# EAGLE design ecg_prototype_2 (EAGLE 9.6.1)
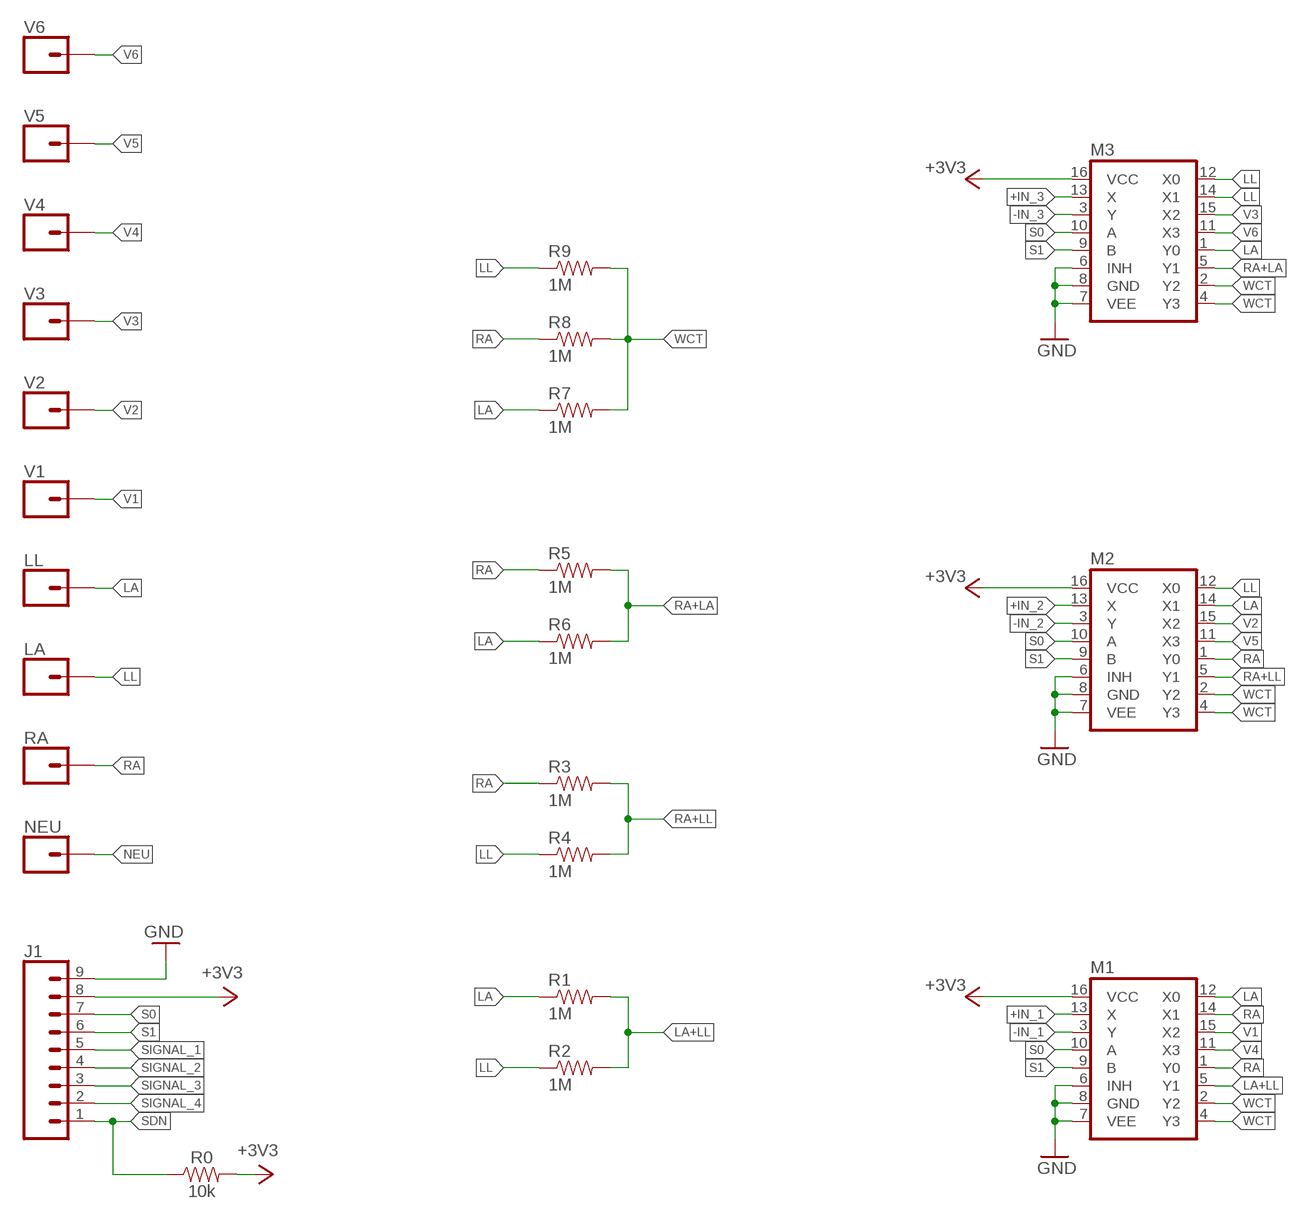
[diagram p0: schematic, sheet 1, part 1 of 2]
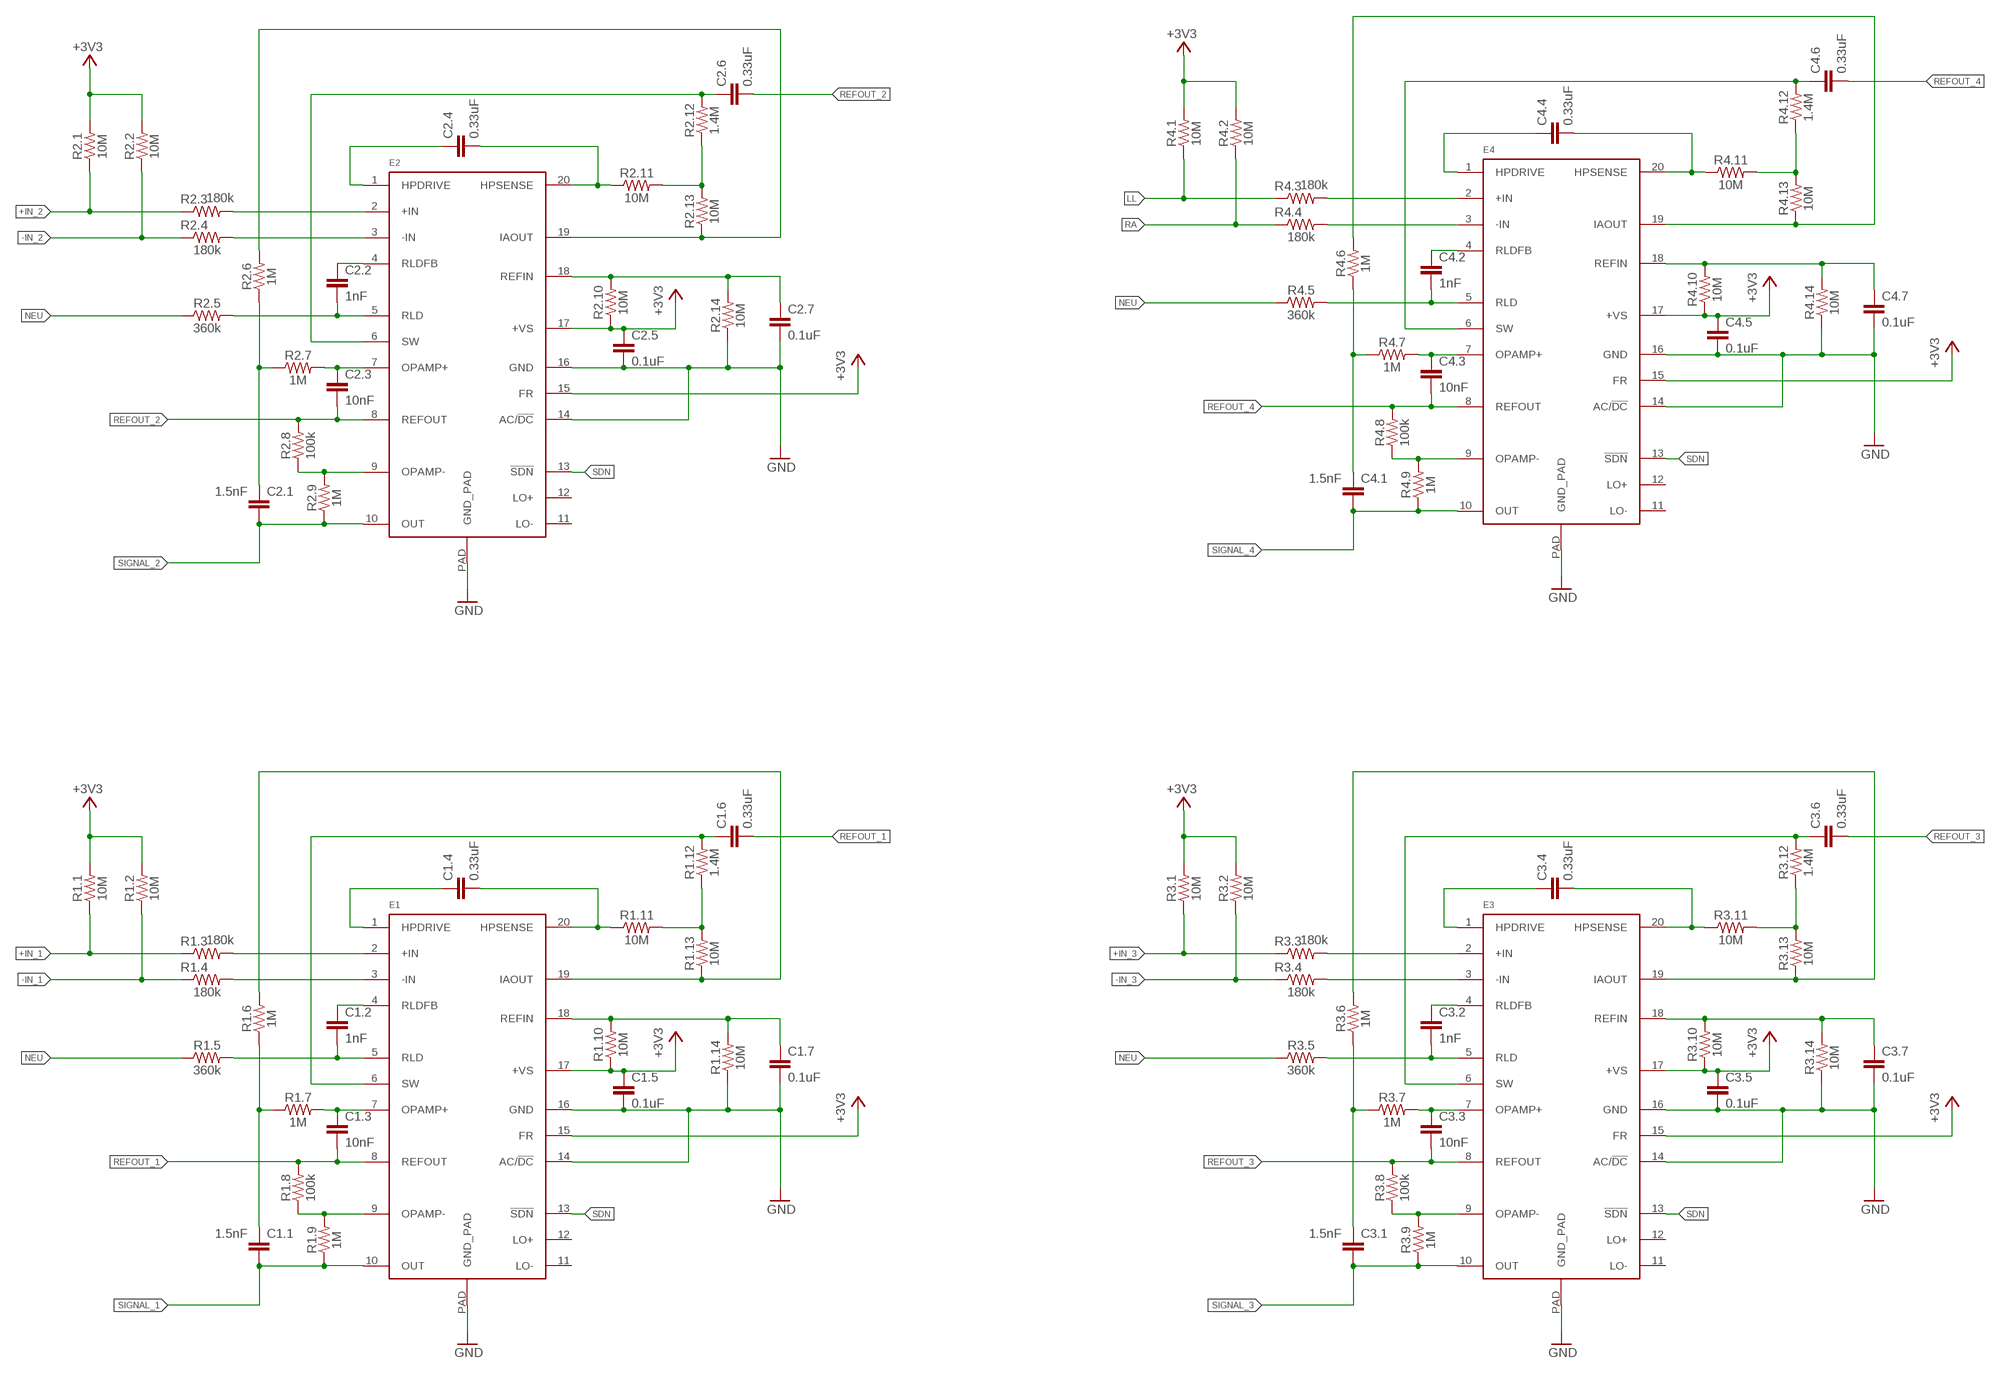
[diagram p1: schematic, sheet 1, part 2 of 2]

## Parts
C1.1  1.5nF  CAP0603-CAP  [0603-CAP]
C1.2  1nF  CAP0603-CAP  [0603-CAP]
C1.3  10nF  CAP0603-CAP  [0603-CAP]
C1.4  0.33uF  CAP0805  [0805]
C1.5  0.1uF  CAP0603-CAP  [0603-CAP]
C1.6  0.33uF  CAP0805  [0805]
C1.7  0.1uF  CAP0603-CAP  [0603-CAP]
C2.1  1.5nF  CAP0603-CAP  [0603-CAP]
C2.2  1nF  CAP0603-CAP  [0603-CAP]
C2.3  10nF  CAP0603-CAP  [0603-CAP]
C2.4  0.33uF  CAP0805  [0805]
C2.5  0.1uF  CAP0603-CAP  [0603-CAP]
C2.6  0.33uF  CAP0805  [0805]
C2.7  0.1uF  CAP0603-CAP  [0603-CAP]
C3.1  1.5nF  CAP0603-CAP  [0603-CAP]
C3.2  1nF  CAP0603-CAP  [0603-CAP]
C3.3  10nF  CAP0603-CAP  [0603-CAP]
C3.4  0.33uF  CAP0805  [0805]
C3.5  0.1uF  CAP0603-CAP  [0603-CAP]
C3.6  0.33uF  CAP0805  [0805]
C3.7  0.1uF  CAP0603-CAP  [0603-CAP]
C4.1  1.5nF  CAP0603-CAP  [0603-CAP]
C4.2  1nF  CAP0603-CAP  [0603-CAP]
C4.3  10nF  CAP0603-CAP  [0603-CAP]
C4.4  0.33uF  CAP0805  [0805]
C4.5  0.1uF  CAP0603-CAP  [0603-CAP]
C4.6  0.33uF  CAP0805  [0805]
C4.7  0.1uF  CAP0603-CAP  [0603-CAP]
E1  AD8232ACPZ-R7  AD8232  [LFCSP_20]
E2  AD8232ACPZ-R7  AD8232  [LFCSP_20]
E3  AD8232ACPZ-R7  AD8232  [LFCSP_20]
E4  AD8232ACPZ-R7  AD8232  [LFCSP_20]
J1  CONN_09  [1X09]
LA  CONN_01  [1X01]
LL  CONN_01  [1X01]
M1  74HC4052D  [SO16]
M2  74HC4052D  [SO16]
M3  74HC4052D  [SO16]
NEU  CONN_01  [1X01]
R0  10k  10KOHM-0603-1/10W-1%  [0603]
R1  1M  RESISTOR0402-RES  [0402-RES]
R1.1  10M  RESISTOR0603  [0603]
R1.2  10M  RESISTOR0603  [0603]
R1.3  180k  RESISTOR0603  [0603]
R1.4  180k  RESISTOR0603  [0603]
R1.5  360k  RESISTOR0603  [0603]
R1.6  1M  RESISTOR0603  [0603]
R1.7  1M  RESISTOR0603  [0603]
R1.8  100k  RESISTOR0603  [0603]
R1.9  1M  RESISTOR0603  [0603]
R1.10  10M  RESISTOR0603  [0603]
R1.11  10M  RESISTOR0603  [0603]
R1.12  1.4M  RESISTOR0603  [0603]
R1.13  10M  RESISTOR0603  [0603]
R1.14  10M  RESISTOR0603  [0603]
R2  1M  RESISTOR0402-RES  [0402-RES]
R2.1  10M  RESISTOR0603  [0603]
R2.2  10M  RESISTOR0603  [0603]
R2.3  180k  RESISTOR0603  [0603]
R2.4  180k  RESISTOR0603  [0603]
R2.5  360k  RESISTOR0603  [0603]
R2.6  1M  RESISTOR0603  [0603]
R2.7  1M  RESISTOR0603  [0603]
R2.8  100k  RESISTOR0603  [0603]
R2.9  1M  RESISTOR0603  [0603]
R2.10  10M  RESISTOR0603  [0603]
R2.11  10M  RESISTOR0603  [0603]
R2.12  1.4M  RESISTOR0603  [0603]
R2.13  10M  RESISTOR0603  [0603]
R2.14  10M  RESISTOR0603  [0603]
R3  1M  RESISTOR0402-RES  [0402-RES]
R3.1  10M  RESISTOR0603  [0603]
R3.2  10M  RESISTOR0603  [0603]
R3.3  180k  RESISTOR0603  [0603]
R3.4  180k  RESISTOR0603  [0603]
R3.5  360k  RESISTOR0603  [0603]
R3.6  1M  RESISTOR0603  [0603]
R3.7  1M  RESISTOR0603  [0603]
R3.8  100k  RESISTOR0603  [0603]
R3.9  1M  RESISTOR0603  [0603]
R3.10  10M  RESISTOR0603  [0603]
R3.11  10M  RESISTOR0603  [0603]
R3.12  1.4M  RESISTOR0603  [0603]
R3.13  10M  RESISTOR0603  [0603]
R3.14  10M  RESISTOR0603  [0603]
R4  1M  RESISTOR0402-RES  [0402-RES]
R4.1  10M  RESISTOR0603  [0603]
R4.2  10M  RESISTOR0603  [0603]
R4.3  180k  RESISTOR0603  [0603]
R4.4  180k  RESISTOR0603  [0603]
R4.5  360k  RESISTOR0603  [0603]
R4.6  1M  RESISTOR0603  [0603]
R4.7  1M  RESISTOR0603  [0603]
R4.8  100k  RESISTOR0603  [0603]
R4.9  1M  RESISTOR0603  [0603]
R4.10  10M  RESISTOR0603  [0603]
R4.11  10M  RESISTOR0603  [0603]
R4.12  1.4M  RESISTOR0603  [0603]
R4.13  10M  RESISTOR0603  [0603]
R4.14  10M  RESISTOR0603  [0603]
R5  1M  RESISTOR0402-RES  [0402-RES]
R6  1M  RESISTOR0402-RES  [0402-RES]
R7  1M  RESISTOR0402-RES  [0402-RES]
R8  1M  RESISTOR0402-RES  [0402-RES]
R9  1M  RESISTOR0402-RES  [0402-RES]
RA  CONN_01  [1X01]
V1  CONN_01  [1X01]
V2  CONN_01  [1X01]
V3  CONN_01  [1X01]
V4  CONN_01  [1X01]
V5  CONN_01  [1X01]
V6  CONN_01  [1X01]

## Nets
+3V3: C1.5.1 C2.5.1 C3.5.1 C4.5.1 E1.15(FR) E1.17(+VS) E2.15(FR) E2.17(+VS) E3.15(FR) E3.17(+VS) E4.15(FR) E4.17(+VS) J1.8 M1.16(VCC) M2.16(VCC) M3.16(VCC) R0.2 R1.1.2 R1.2.2 R1.10.1 R2.1.2 R2.2.2 R2.10.1 R3.1.2 R3.2.2 R3.10.1 R4.1.2 R4.2.2 R4.10.1
+IN_1: M1.13(X) R1.1.1 R1.3.1
+IN_2: M2.13(X) R2.1.1 R2.3.1
+IN_3: M3.13(X) R3.1.1 R3.3.1
-IN_1: M1.3(Y) R1.2.1 R1.4.1
-IN_2: M2.3(Y) R2.2.1 R2.4.1
-IN_3: M3.3(Y) R3.2.1 R3.4.1
GND: C1.5.2 C1.7.2 C2.5.2 C2.7.2 C3.5.2 C3.7.2 C4.5.2 C4.7.2 E1.14(AC/!DC) E1.16(GND) E1.PAD(GND_PAD) E2.14(AC/!DC) E2.16(GND) E2.PAD(GND_PAD) E3.14(AC/!DC) E3.16(GND) E3.PAD(GND_PAD) E4.14(AC/!DC) E4.16(GND) E4.PAD(GND_PAD) J1.9 M1.6(INH) M1.7(VEE) M1.8(GND) M2.6(INH) M2.7(VEE) M2.8(GND) M3.6(INH) M3.7(VEE) M3.8(GND) R1.14.1 R2.14.1 R3.14.1 R4.14.1
LA: LL.1 M1.12(X0) M2.14(X1) M3.1(Y0) R1.1 R6.1 R7.1
LA+LL: M1.5(Y1) R1.2 R2.2
LL: LA.1 M2.12(X0) M3.12(X0) M3.14(X1) R2.1 R4.1 R4.1.1 R4.3.1 R9.1
N$1: E1.9(OPAMP-) R1.8.1 R1.9.2
N$2: E2.2(+IN) R2.3.2
N$3: E1.2(+IN) R1.3.2
N$4: E1.3(-IN) R1.4.2
N$5: E2.3(-IN) R2.4.2
N$6: C1.1.1 R1.6.1 R1.7.1
N$7: C1.3.1 E1.7(OPAMP+) R1.7.2
N$8: C1.2.1 E1.4(RLDFB)
N$9: C1.2.2 E1.5(RLD) R1.5.2
N$10: E1.19(IAOUT) R1.6.2 R1.13.1
N$11: C1.6.1 E1.6(SW) R1.12.2
N$12: C1.7.1 E1.18(REFIN) R1.10.2 R1.14.2
N$13: R1.11.2 R1.12.1 R1.13.2
N$14: C1.4.2 E1.20(HPSENSE) R1.11.1
N$15: C1.4.1 E1.1(HPDRIVE)
N$16: C2.2.1 E2.4(RLDFB)
N$17: C2.2.2 E2.5(RLD) R2.5.2
N$19: C2.1.1 R2.6.1 R2.7.1
N$20: C2.3.1 E2.7(OPAMP+) R2.7.2
N$21: E2.9(OPAMP-) R2.8.1 R2.9.2
N$22: E2.19(IAOUT) R2.6.2 R2.13.1
N$23: C2.6.1 E2.6(SW) R2.12.2
N$24: R2.11.2 R2.12.1 R2.13.2
N$25: C2.4.2 E2.20(HPSENSE) R2.11.1
N$26: C2.4.1 E2.1(HPDRIVE)
N$27: C2.7.1 E2.18(REFIN) R2.10.2 R2.14.2
N$28: E3.2(+IN) R3.3.2
N$29: E3.3(-IN) R3.4.2
N$30: C3.2.1 E3.4(RLDFB)
N$31: C3.2.2 E3.5(RLD) R3.5.2
N$32: C3.1.1 R3.6.1 R3.7.1
N$33: C3.3.1 E3.7(OPAMP+) R3.7.2
N$34: E3.9(OPAMP-) R3.8.1 R3.9.2
N$35: E3.19(IAOUT) R3.6.2 R3.13.1
N$36: C3.6.1 E3.6(SW) R3.12.2
N$37: R3.11.2 R3.12.1 R3.13.2
N$38: C3.4.2 E3.20(HPSENSE) R3.11.1
N$39: C3.4.1 E3.1(HPDRIVE)
N$40: C3.7.1 E3.18(REFIN) R3.10.2 R3.14.2
N$41: E4.2(+IN) R4.3.2
N$42: E4.3(-IN) R4.4.2
N$43: C4.2.1 E4.4(RLDFB)
N$44: C4.2.2 E4.5(RLD) R4.5.2
N$45: C4.1.1 R4.6.1 R4.7.1
N$46: C4.3.1 E4.7(OPAMP+) R4.7.2
N$47: E4.9(OPAMP-) R4.8.1 R4.9.2
N$48: E4.19(IAOUT) R4.6.2 R4.13.1
N$49: C4.6.1 E4.6(SW) R4.12.2
N$50: R4.11.2 R4.12.1 R4.13.2
N$51: C4.4.2 E4.20(HPSENSE) R4.11.1
N$52: C4.4.1 E4.1(HPDRIVE)
N$53: C4.7.1 E4.18(REFIN) R4.10.2 R4.14.2
NEU: NEU.1 R1.5.1 R2.5.1 R3.5.1 R4.5.1
RA: M1.1(Y0) M1.14(X1) M2.1(Y0) R3.1 R4.2.1 R4.4.1 R5.1 R8.1 RA.1
RA+LA: M3.5(Y1) R5.2 R6.2
RA+LL: M2.5(Y1) R3.2 R4.2
REFOUT_1: C1.3.2 C1.6.2 E1.8(REFOUT) R1.8.2
REFOUT_2: C2.3.2 C2.6.2 E2.8(REFOUT) R2.8.2
REFOUT_3: C3.3.2 C3.6.2 E3.8(REFOUT) R3.8.2
REFOUT_4: C4.3.2 C4.6.2 E4.8(REFOUT) R4.8.2
S0: J1.7 M1.10(A) M2.10(A) M3.10(A)
S1: J1.6 M1.9(B) M2.9(B) M3.9(B)
SDN: E1.13(!SDN) E2.13(!SDN) E3.13(!SDN) E4.13(!SDN) J1.1 R0.1
SIGNAL_1: C1.1.2 E1.10(OUT) J1.5 R1.9.1
SIGNAL_2: C2.1.2 E2.10(OUT) J1.4 R2.9.1
SIGNAL_3: C3.1.2 E3.10(OUT) J1.3 R3.9.1
SIGNAL_4: C4.1.2 E4.10(OUT) J1.2 R4.9.1
V1: M1.15(X2) V1.1
V2: M2.15(X2) V2.1
V3: M3.15(X2) V3.1
V4: M1.11(X3) V4.1
V5: M2.11(X3) V5.1
V6: M3.11(X3) V6.1
WCT: M1.2(Y2) M1.4(Y3) M2.2(Y2) M2.4(Y3) M3.2(Y2) M3.4(Y3) R7.2 R8.2 R9.2
Unconnected: E1.11(LO-) E1.12(LO+) E2.11(LO-) E2.12(LO+) E3.11(LO-) E3.12(LO+) E4.11(LO-) E4.12(LO+)

## Library data of the parts
C1.1-C1.7 C2.1-C2.7 C3.1-C3.7 C4.1-C4.7 = SparkFun-Passives:CAP: Capacitor Standard 0603 ceramic capacitor, and 0.1" leaded capacitor.
E1-E4 = SparkFun-Sensors:AD8232: AD8232 Single Lead Heart Rate Monitor IC Datasheet <https://cdn.sparkfun.com/datasheets/Sensors/Biometric/AD8232.pdf> SparkFun Products SparkFun Single Lead Heart Rate Monitor - AD8232 <https://www.sparkfun.com/products/12650> (SEN-12650); PROD_ID: IC-11886
J1 = SparkFun-Connectors:CONN_09: Multi connection point. Often used as Generic Header-pin footprint for 0.1 inch spaced/style header connections On any of the 0.1 inch spaced packages, you can populate with these: Break Away Headers - Straight <https://www.sparkfun.com/products/116> (PRT-00116) Break Away Male Headers - Right Angle <https://www.sparkfun.com/products/553> (PRT-00553) Female Headers <https://www.sparkfun.com/products/115> (PRT-00115) Break Away Headers - Machine Pin <https://www.sparkfun.com/products/117> (PRT-00117) Break Away Female Headers - Swiss Machine Pin <https://www.sparkfun.com/products/743> (PRT-00743) For SCREWTERMINALS and SPRING TERMINALS visit here: Screw Terimnals on SparkFun.com <https://www.sparkfun.com/search/results?term=Screw+Terminals> (5mm/3.5mm/2.54mm spacing) This device is also useful as a general connection point to wire up your design to another part of your project. Our various solder wires solder well into these plated through hole pads. Hook-Up Wire - Assortment (Stranded, 22 AWG) <https://www.sparkfun.com/products/11375> (PRT-11375) Hook-Up Wire - Assortment (Solid Core, 22 AWG) <https://www.sparkfun.com/products/11367> (PRT-11367) View the entire wire category on our website here <https://www.sparkfun.com/categories/141> Special notes: Molex polarized connector foot print use with SKU : PRT-08231 with associated crimp pins and housings. 1MM SMD Version SKU: PRT-10208 NOTES ON THE VARIANTS LOCK and LOCK_LONGPADS... This footprint was designed to help hold the alignment of a through-hole component (i.e. 6-pin header) while soldering it into place. You may notice that each hole has been shifted either up or down by 0.005 of an inch from it's more standard position (which is a perfectly straight line). This slight alteration caused the pins (the squares in the middle) to touch the edges of the holes. Because they are alternating, it causes a "brace" to hold the component in place. 0.005 has proven to be the perfect amount of "off-center" position when using our standard breakaway headers. Although looks a little odd when you look at the bare footprint, once you have a header in there, the alteration is very hard to notice. Also,if you push a header all the way into place, it is covered up entirely on the bottom side.
LA LL NEU RA V1-V6 = SparkFun-Connectors:CONN_01: Single connection point. Often used as Generic Header-pin footprint for 0.1 inch spaced/style header connections On any of the 0.1 inch spaced packages, you can populate with these: Break Away Headers - Straight <https://www.sparkfun.com/products/116> (PRT-00116) Break Away Male Headers - Right Angle <https://www.sparkfun.com/products/553> (PRT-00553) Female Headers <https://www.sparkfun.com/products/115> (PRT-00115) Break Away Headers - Machine Pin <https://www.sparkfun.com/products/117> (PRT-00117) Break Away Female Headers - Swiss Machine Pin <https://www.sparkfun.com/products/743> (PRT-00743) This device is also useful as a general connection point to wire up your design to another part of your project. Our various solder wires solder well into these plated through hole pads. Hook-Up Wire - Assortment (Stranded, 22 AWG) <https://www.sparkfun.com/products/11375> (PRT-11375) Hook-Up Wire - Assortment (Solid Core, 22 AWG) <https://www.sparkfun.com/products/11367> (PRT-11367) View the entire wire category on our website here <https://www.sparkfun.com/categories/141> Special notes: SMTSO-256-ET is a "flush mount" nut for a 4-40 screw. We mostly use this on specialty testbeds; it is a nice way to connect hardware to your PCB at an adjustable hieght. Also note, the SNAP packages are for using a snappable style connector. We sell a baggie of snaps and they are also used on two LilyPad designs: Snap Assortment - 30 pack (male and female) <https://www.sparkfun.com/products/11347> (DEV-11347) LilyPad Arduino SimpleSnap <https://www.sparkfun.com/products/10941> (DEV-10941) LilyPad SimpleSnap Protoboard <https://www.sparkfun.com/products/10940> (DEV-10940)
M1-M3 = SparkFun-IC-Logic:74*4052: Dual 4:1 Analog Mux Dual four-channel analog MULTIPLEXER / DEMULTIPLEXER SparkFun Products SparkFun Vernier Interface Shield <https://www.sparkfun.com/products/12858> (DEV-12858); PROD_ID: IC-13103
R0 = SparkFun-Resistors:10KOHM: 10kΩ resistor A resistor is a passive two-terminal electrical component that implements electrical resistance as a circuit element. Resistors act to reduce current flow, and, at the same time, act to lower voltage levels within circuits. - Wikipedia; PROD_ID: RES-00824
R1-R9 = SparkFun:RESISTOR: Resistor Basic schematic elements and footprints for 0603, 1206, and PTH resistors.
R1.1-R1.14 R2.1-R2.14 R3.1-R3.14 R4.1-R4.14 = SparkFun-Resistors:RESISTOR: Generic Resistor Package

## Board
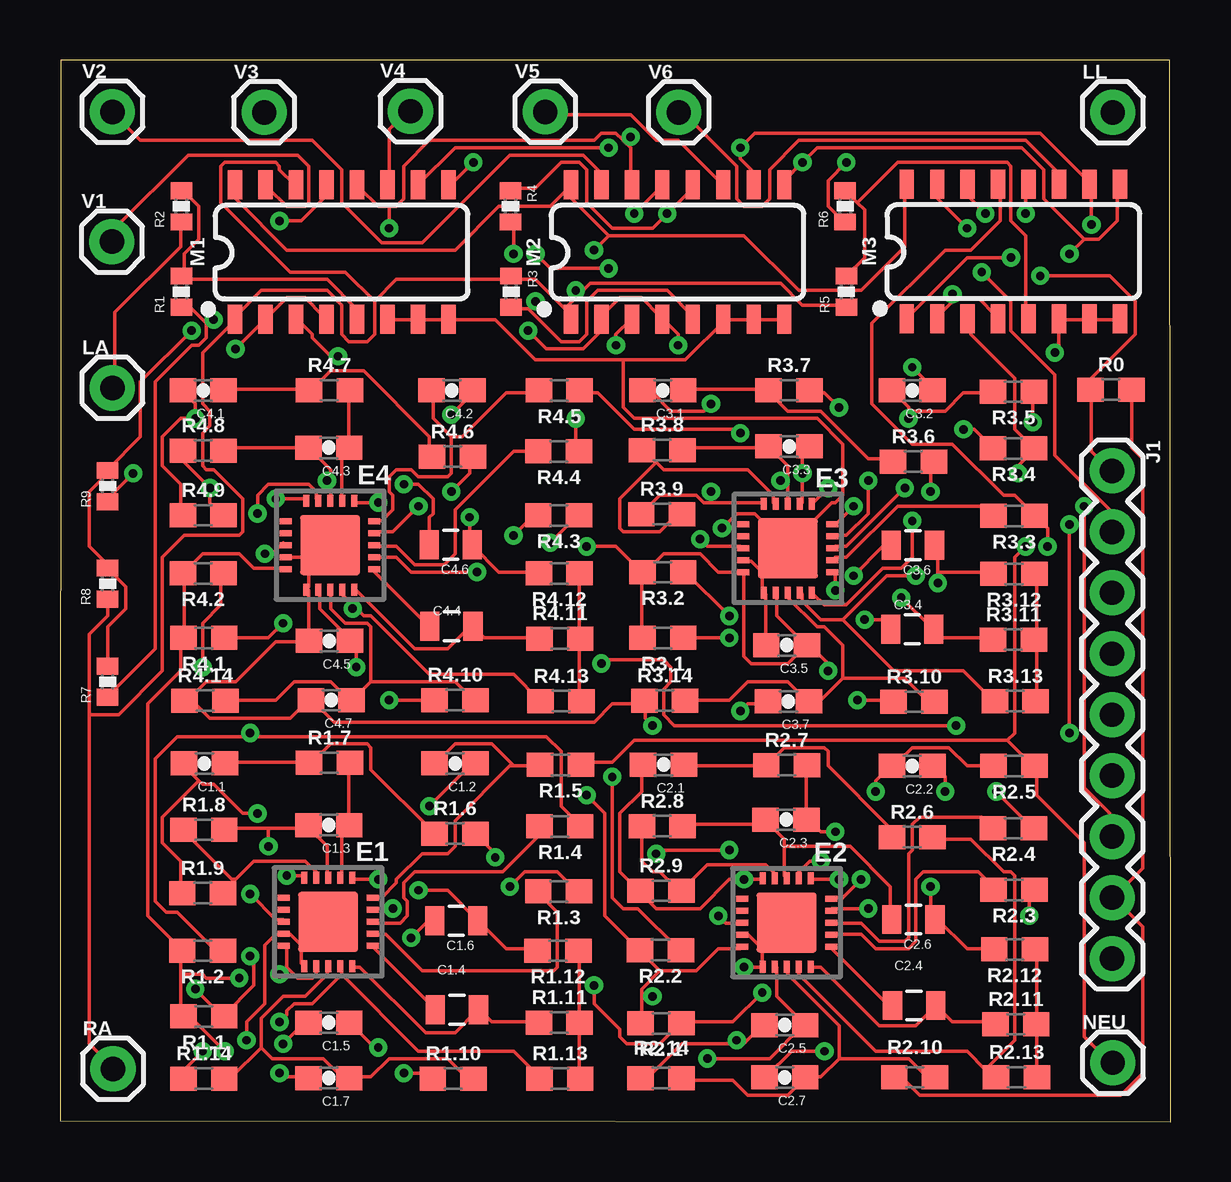
[diagram p2: board, top side]
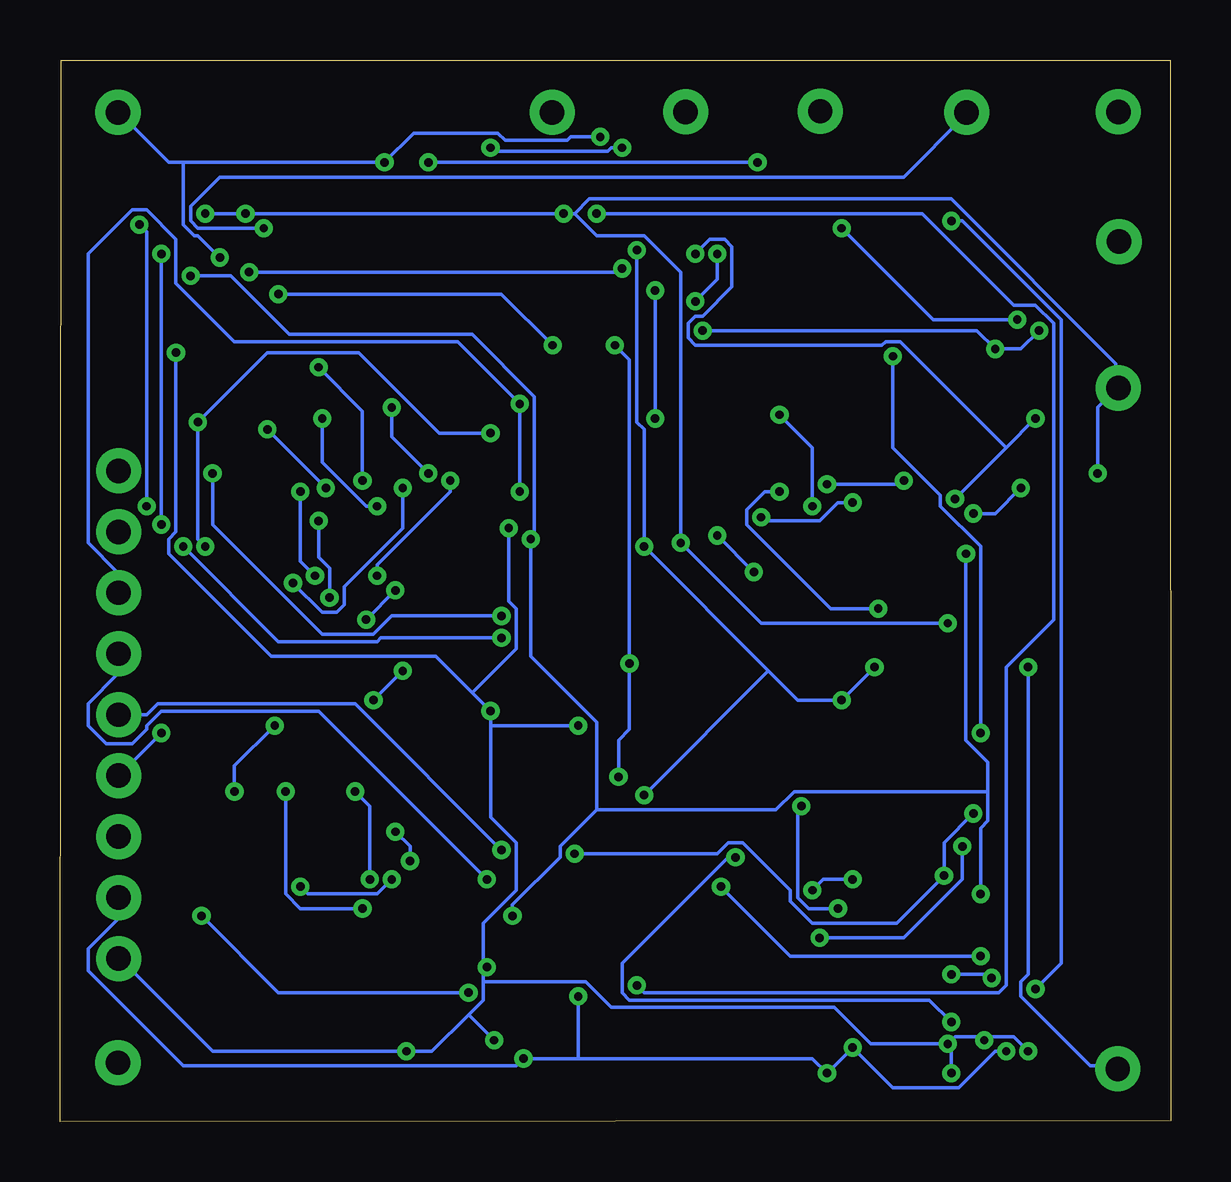
[diagram p3: board, bottom side, seen from below]

Size 46.28 x 44.25 mm. Coordinates in mm from the lower left corner, seen from the top.
Outline: 0,0.05 46.28,0 46.23,44.25 0.03,44.25 0,0.05
Copper layers (1*16): Top 0.035mm / dielectric 1.5mm / Bottom 0.035mm
Design rules "default": minimum track width 6mil, minimum drill 0.35mm, track to track 6mil, track to pad 6mil, pad to pad 6mil, via to via 6mil, smd to smd 6mil, copper to edge 40mil, drill to drill 6mil, minimum pad ring 10mil, minimum via ring 8mil, stop-mask expansion 4mil, vias tented up to drill 0mil, thermal gap 10mil

### Footprints (pad centres in the part's own frame; a part is rotated, then mirrored left to right if it is on the bottom)
0603-CAP = smd 1.1 x 1: 1 -0.85,0; 2 0.85,0
0805 = smd 0.8 x 1.2: 1 -0.9,0; 2 0.9,0
LFCSP_20 = smd 0.5 x 0.25: 1 -1.85,1; 2 -1.85,0.5; 3 -1.85,0; 4 -1.85,-0.5; 5 -1.85,-1; 11 1.85,-1; 12 1.85,-0.5; 13 1.85,0; 14 1.85,0.5; 15 1.85,1 | smd 0.25 x 0.5: 6 -1,-1.85; 7 -0.5,-1.85; 8 0,-1.85; 9 0.5,-1.85; 10 1,-1.85; 16 1,1.85; 17 0.5,1.85; 18 0,1.85; 19 -0.5,1.85; 20 -1,1.85 | smd 2.5 x 2.5: PAD 0,0
1X09 = drill 1.016 pad 1.88: 1 0,0; 2 2.54,0; 3 5.08,0; 4 7.62,0; 5 10.16,0; 6 12.7,0; 7 15.24,0; 8 17.78,0; 9 20.32,0
1X01 = drill 1.016 pad 1.88: 1 0,0
SO16 = smd 0.6 x 1.2: 1 -4.445,-2.8; 2 -3.175,-2.8; 3 -1.905,-2.8; 4 -0.635,-2.8; 5 0.635,-2.8; 6 1.905,-2.8; 7 3.175,-2.8; 8 4.445,-2.8; 9 4.445,2.8; 10 3.175,2.8; 11 1.905,2.8; 12 0.635,2.8; 13 -0.635,2.8; 14 -1.905,2.8; 15 -3.175,2.8; 16 -4.445,2.8
0603 = smd 1.1 x 1: 1 -0.85,0; 2 0.85,0
0402-RES = smd 0.7 x 0.9: 1 -0.65,0; 2 0.65,0

### Placement (x,y rotation side)
C1.1  6.02,14.94 180 top
C1.2  16.46,14.94 180 top
C1.3  11.2,12.37 180 top
C1.4  16.54,4.67 0 top
C1.5  11.2,4.14 180 top
C1.6  16.51,8.38 180 top
C1.7  11.2,1.83 180 top
C2.1  25.15,14.88 180 top
C2.2  35.51,14.83 180 top
C2.3  30.25,12.6 180 top
C2.4  35.59,4.85 0 top
C2.5  30.2,4.04 180 top
C2.6  35.56,8.43 180 top
C2.7  30.2,1.85 180 top
C3.1  25.12,30.48 180 top
C3.2  35.51,30.48 180 top
C3.3  30.38,28.14 180 top
C3.4  35.51,20.52 0 top
C3.5  30.28,19.86 180 top
C3.6  35.53,24.03 180 top
C3.7  30.35,17.53 180 top
C4.1  5.97,30.48 180 top
C4.2  16.33,30.48 180 top
C4.3  11.2,28.09 180 top
C4.4  16.31,20.65 0 top
C4.5  11.23,20.04 180 top
C4.6  16.28,24.05 180 top
C4.7  11.3,17.58 180 top
E1  11.18,8.33 180 top
E2  30.28,8.31 180 top
E3  30.33,23.9 180 top
E4  11.25,24.03 180 top
J1  43.84,27.13 270 top
LA  2.18,30.58 0 top
LL  43.87,42.06 0 top
M1  11.73,36.25 0 top
M2  25.73,36.25 0 top
M3  39.73,36.27 0 top
NEU  43.87,2.46 0 top
R0  43.79,30.51 0 top
R1  5.05,34.59 90 top
R1.1  5.99,4.39 180 top
R1.2  5.94,7.14 180 top
R1.3  20.78,9.6 180 top
R1.4  20.83,12.32 180 top
R1.5  20.85,14.88 180 top
R1.6  16.46,12.01 0 top
R1.7  11.23,14.96 0 top
R1.8  5.99,12.17 0 top
R1.9  5.94,9.53 0 top
R1.10  16.38,1.8 0 top
R1.11  20.8,4.14 0 top
R1.12  20.75,7.14 180 top
R1.13  20.83,1.8 0 top
R1.14  5.99,1.8 0 top
R2  5.05,38.15 90 top
R2.1  25.04,4.11 180 top
R2.2  25.02,7.16 180 top
R2.3  39.75,9.68 180 top
R2.4  39.73,12.24 180 top
R2.5  39.75,14.83 180 top
R2.6  35.51,11.86 0 top
R2.7  30.28,14.86 0 top
R2.8  25.1,12.32 0 top
R2.9  25.04,9.63 0 top
R2.10  35.61,1.85 0 top
R2.11  39.83,4.06 0 top
R2.12  39.78,7.19 180 top
R2.13  39.85,1.85 0 top
R2.14  25.04,1.83 0 top
R3  18.8,34.59 270 top
R3.1  25.12,20.17 180 top
R3.2  25.12,22.91 180 top
R3.3  39.75,25.25 180 top
R3.4  39.73,28.07 180 top
R3.5  39.73,30.43 180 top
R3.6  35.56,27.51 0 top
R3.7  30.38,30.48 0 top
R3.8  25.1,27.99 0 top
R3.9  25.07,25.32 0 top
R3.10  35.59,17.5 0 top
R3.11  39.73,20.09 0 top
R3.12  39.75,22.83 180 top
R3.13  39.8,17.53 0 top
R3.14  25.2,17.55 0 top
R4  18.77,38.15 270 top
R4.1  5.99,20.17 180 top
R4.2  5.97,22.86 180 top
R4.3  20.78,25.27 180 top
R4.4  20.78,27.94 180 top
R4.5  20.8,30.48 180 top
R4.6  16.36,27.71 0 top
R4.7  11.23,30.48 0 top
R4.8  5.97,27.97 0 top
R4.9  5.97,25.27 0 top
R4.10  16.46,17.58 0 top
R4.11  20.83,20.14 0 top
R4.12  20.8,22.86 180 top
R4.13  20.88,17.53 0 top
R4.14  6.05,17.55 0 top
R5  32.77,34.59 90 top
R6  32.72,38.15 90 top
R7  1.98,18.34 90 top
R8  1.98,22.43 90 top
R9  1.98,26.49 90 top
RA  2.21,2.21 0 top
V1  2.16,36.68 0 top
V2  2.18,42.09 0 top
V3  8.51,42.06 0 top
V4  14.61,42.11 0 top
V5  20.22,42.09 0 top
V6  25.78,42.06 0 top

### Tracks (layer width: path | path; a pad name or v marks a point on that pad's centre or on a via)
+3V3  (via drill 0.35)
  Top 0.152: E4.17 10.82,22.15 10.82,21.39 12.04,20.17 C4.5.1 12.19,20.01 12.34,19.86 v12.34,18.95 | v13.72,17.58 R4.10.1 | 24.23,22.91 24.23,20.17 R3.1.2 | 31.09,19.86 29.87,21.08 29.87,22 E3.17 | v33.22,17.58 34.59,17.58 R3.10.1 | v32,18.8 32,19.1 31.24,19.86 C3.5.1 31.09,19.86 | 31.09,19.86 30.33,19.1 28.8,19.1 28.5,19.41 28.5,22.91 E3.15 28.35,22.91 27.43,22.91 26.67,23.67 25.15,23.67 24.38,22.91 R3.2.2 24.23,22.91 | v21.95,23.98 23.16,23.98 24.23,22.91 | 21.03,38.76 21.18,38.91 M2.16 21.03,38.76 | 21.03,38.76 20.42,38.15 18.29,38.15 16.46,36.32 9.45,36.32 7.32,38.46 7.32,38.91 M1.16 | 22.86,36.93 28.5,36.93 30.79,34.65 33.38,34.65 35.2,36.47 35.2,39.06 M3.16 | 21.03,38.76 22.86,36.93 | 22.86,36.93 v22.25,36.32 | 43.89,9.35 45.11,8.13 45.11,2.03 44.2,1.12 35.81,1.12 35.2,1.73 34.9,1.73 R2.10.1 | 43.89,9.35 45.11,10.57 45.11,27.63 44.65,28.09 44.65,30.38 R0.2 | 43.89,9.35 J1.8 | E4.15 9.3,23.06 8.08,23.06 7.47,23.67 5.94,23.67 5.18,22.91 R4.2.2 5.18,22.76 5.18,20.17 R4.1.2 5.03,20.17 5.03,18.8 3.66,17.42 3.66,8.58 5.03,7.21 R1.2.2 5.03,7.06 5.03,6.15 | 9.45,6.45 9.91,5.99 10.52,5.99 10.67,6.15 10.67,6.45 E1.17 | 9.45,6.45 9.45,7.21 E1.15 | 5.03,6.15 5.03,4.47 R1.1.2 5.18,4.32 5.49,4.32 v6.86,2.95 | v9.14,6.15 9.45,6.45 | v7.47,5.99 6.1,5.99 5.94,6.15 5.03,6.15 | 24.99,6.3 26.52,6.3 27.43,7.21 28.35,7.21 E2.15 | 24.99,6.3 24.23,7.06 R2.2.2 24.08,7.21 22.71,8.58 22.71,12.85 v21.95,13.61 | 24.23,5.23 24.23,5.54 24.99,6.3 | 24.23,5.23 24.23,4.17 R2.1.2 | E2.17 29.87,6.45 29.87,5.23 30.94,4.17 C2.5.1 30.94,4.01 29.57,2.64 v26.98,2.64 | v13.26,3.1 13.11,3.1 12.19,4.01 C1.5.1
  Top 0.152: v14.33,2.03 15.24,2.03 15.39,1.88 R1.10.1 | v24.69,5.23 24.23,5.23
  Bottom 0.152: v12.34,18.95 v13.72,17.58 15.54,17.58 16.76,18.8 | v32,18.8 v33.22,17.58 | 16.76,18.8 v21.95,23.98 21.95,28.85 22.25,29.16 v22.25,36.32 | v9.14,6.15 7.62,6.15 v7.47,5.99 | 24.69,2.64 14.94,2.64 v14.33,2.03 v13.26,3.1 11.58,1.42 8.84,1.42 7.32,2.95 v6.86,2.95 | 24.69,2.64 v26.98,2.64 27.28,2.34 41.15,2.34 45.11,6.3 45.11,7.21 43.89,8.43 43.89,9.35 J1.8 | 24.69,2.64 v24.69,5.23 | v21.95,13.61 16.76,18.8
+IN_1  (via drill 0.35)
  Top 0.152: v7.92,6.91 8.08,6.76 8.08,5.69 6.86,4.47 R1.1.1 6.71,4.47 v5.64,5.54 | v18.75,9.8 19.36,10.41 20.73,10.41 21.49,9.65 R1.3.1 | v9.14,37.54 10.06,37.54 10.97,38.46 10.97,38.91 M1.13
  Bottom 0.152: v7.92,6.91 15.85,6.91 v18.75,9.8 | v9.14,37.54 8.69,37.54 4.57,33.43 4.57,6.6 v5.64,5.54
+IN_2  (via drill 0.35)
  Top 0.152: v29.26,5.38 28.04,4.17 25.91,4.17 R2.1.1 25.76,4.01 24.99,3.25 23.62,3.25 23.32,3.56 23.32,3.86 22.25,4.93 v22.25,5.69 | v40.39,8.58 40.39,9.5 40.54,9.65 R2.3.1 | v23.93,37.85 24.99,38.91 M2.13
  Bottom 0.152: v29.26,5.38 37.19,5.38 v40.39,8.58 | v23.93,37.85 10.36,37.85 6.55,34.04 5.64,34.04 4.88,33.27 4.88,20.93 6.86,18.95 6.86,5.69 7.16,5.38 21.95,5.38 v22.25,5.69
+IN_3  (via drill 0.35)
  Top 0.152: v27.89,20.17 R3.1.1 | v41.15,23.98 41.15,24.74 40.69,25.2 R3.3.1 40.54,25.35 39.78,26.11 39.32,26.11 37.19,28.24 35.51,28.24 33.83,29.92 33.83,33.27 36.88,36.32 37.95,36.32 39.17,37.54 39.17,39.06 M3.13
  Bottom 0.152: v27.89,20.17 32.92,20.17 33.07,20.01 37.19,20.01 v41.15,23.98
-IN_1  (via drill 0.35)
  Top 0.152: 7.92,16.05 20.27,16.05 20.88,15.44 20.88,13.16 21.64,12.39 R1.4.1 | 7.92,16.05 4.88,16.05 3.96,15.14 3.96,9.19 4.42,8.74 4.88,8.74 6.4,7.21 6.71,7.21 R1.2.1 | v11.58,31.9 11.28,31.9 10.52,32.66 10.52,32.82 9.91,33.43 M1.3 | 7.92,16.05 v7.92,16.2
  Bottom 0.152: v11.58,31.9 11.58,28.09 9.6,26.11 9.6,25.65 7.92,23.98 v7.92,16.2
-IN_2  (via drill 0.35)
  Top 0.152: v23.01,14.38 23.01,9.35 23.47,8.89 24.08,8.89 25.76,7.21 R2.2.1 | v23.16,32.36 23.16,32.82 23.77,33.43 M2.3 | v39.01,13.77 40.54,12.24 R2.4.1 | v37.34,16.51 25.6,16.51 25.15,16.97 25.15,18.03 25.45,18.34 25.45,18.95 25.15,19.25 22.71,19.25 v22.55,19.1
  Bottom 0.152: v23.01,14.38 23.01,15.9 22.55,16.36 v22.55,19.1 22.55,31.75 v23.16,32.36 | v39.01,13.77 39.01,14.83 v37.34,16.51
-IN_3  (via drill 0.35)
  Top 0.152: v27.89,21.08 26.06,22.91 R3.2.1 | v39.93,27.03 39.93,27.33 40.54,27.94 R3.4.1 40.54,28.09 39.78,28.85 39.78,30.99 37.95,32.82 37.95,33.43 M3.3
  Bottom 0.152: v27.89,21.08 32.46,21.08 33.22,20.32 35.36,20.32 39.93,24.89 v39.93,27.03
GND  (via drill 0.35)
  Top 0.152: 29.26,22.91 29.26,22.15 E3.16 29.41,22 29.41,19.86 C3.5.2 | 29.26,22.91 28.8,23.37 28.5,23.37 E3.14 | 30.33,23.98 29.26,22.91 | M1.6 13.72,33.43 14.78,33.43 M1.7 14.94,33.43 16.15,33.43 M1.8 16.31,33.43 18.14,33.43 19.81,31.75 23.47,31.75 | 27.74,33.43 28.8,33.43 M2.7 28.96,33.43 30.18,33.43 M2.8 | 23.47,31.75 26.06,31.75 27.74,33.43 | 27.74,33.43 M2.6 | 30.33,23.98 32.16,25.81 32.31,25.81 32.61,26.11 32.61,28.24 31.55,29.31 23.93,29.31 23.47,29.77 23.47,31.75 | 10.36,23.52 10.67,23.52 11.12,23.98 E4.PAD 10.36,23.52 | 10.36,23.52 9.45,23.52 E4.14 | 10.36,23.52 10.36,22.3 E4.16 10.36,22.15 10.36,20.17 C4.5.2 10.36,20.01 8.99,20.01 7.32,18.34 6.1,18.34 5.33,17.58 R4.14.1 5.33,17.42 5.64,17.42 6.25,16.81 9.6,16.81 10.36,17.58 C4.7.2 10.52,17.58 11.43,16.66 22.25,16.66 23.01,17.42 24.23,17.42 R3.14.1 24.38,17.42 24.38,16.81 v24.69,16.51 | 10.06,7.37 10.06,6.6 E1.16 | 10.06,7.37 9.6,7.82 9.45,7.82 E1.14 9.3,7.82 8.99,7.82 8.53,7.37 8.53,4.93 7.77,4.17 v7.77,3.4 | 10.06,7.37 11.12,8.43 E1.PAD | v5.94,2.95 5.18,2.18 5.18,1.88 R1.14.1 | v9.3,3.25 10.21,4.17 C1.5.2 | v9.14,2.03 9.3,1.88 10.21,1.88 C1.7.2 | 28.19,3.25 28.5,3.25 29.26,4.01 C2.5.2 | 28.19,3.25 25.91,3.25 24.54,1.88 24.23,1.88 R2.14.1 | 29.11,7.37 29.26,7.21 29.26,6.6 E2.16 29.26,6.45 v28.5,6.45 | 29.11,7.37 28.65,7.82 28.5,7.82 E2.14 | 29.11,7.37 30.18,8.43 E2.PAD | M3.8 44.04,33.43 42.98,33.43 M3.7 42.82,33.43 41.76,33.43 M3.6 41.6,33.43 41.6,32.21 v41.45,32.05 | v31.85,2.95 30.48,2.95 29.41,1.88 C2.7.2 | v28.35,17.12 28.65,17.42 29.41,17.42 C3.7.2 | v28.19,3.4 28.19,3.25 | 30.33,23.98 28.96,25.35 28.19,25.35 v27.58,24.74
  Top 0.152: 30.33,23.98 E3.PAD
  Bottom 0.152: v5.94,2.95 6.55,3.56 7.77,3.56 | 7.77,3.56 8.99,3.56 9.14,3.4 | 9.14,3.4 v9.14,2.03 | 9.14,3.4 v9.3,3.25 12.5,3.25 14.02,4.77 23.32,4.77 24.38,5.84 28.65,5.84 | 7.77,3.56 v7.77,3.4 | J1.9 43.74,6.76 39.93,2.95 v31.85,2.95 30.79,2.95 29.26,4.47 | 28.35,16.51 28.35,12.7 27.28,11.63 27.28,9.65 28.65,8.28 28.65,6.45 | 28.35,16.51 v28.35,17.12 29.11,17.88 | 28.65,5.84 28.65,5.08 29.26,4.47 | 28.65,5.84 28.65,6.45 | v41.45,32.05 41.45,24.59 41.76,24.28 41.76,23.67 37.49,19.41 30.63,19.41 29.11,17.88 | 28.65,6.45 v28.5,6.45 | 29.26,4.47 v28.19,3.4 | 28.35,16.51 v24.69,16.51 | v27.58,24.74 27.58,21.69 27.28,21.39 27.28,19.71 29.11,17.88
LA  (via drill 0.35)
  Top 0.152: 6.1,33.27 6.1,32.66 5.79,32.36 5.49,32.36 3.96,30.84 3.96,19.71 1.98,17.73 R7.1 | 6.1,33.27 5.49,33.88 5.18,33.88 R1.1 | 13.72,38.15 14.02,38.15 14.33,38.46 14.33,39.83 15.39,40.89 22.25,40.89 22.55,41.2 23.16,41.2 23.47,40.89 | 13.72,38.15 13.26,38.15 12.5,38.91 M1.12 | 23.47,40.89 23.77,40.59 23.77,39.06 M2.14 | v32.77,39.98 32,39.22 32,38.15 32.61,37.54 R6.1 | v39.62,36.02 37.8,36.02 35.36,33.58 M3.1 | 23.47,40.89 23.62,40.89 v23.77,41.05 | 6.1,33.27 6.25,33.27 v6.4,33.43 | 13.72,38.15 v13.72,37.24
  Bottom 0.152: 41.15,39.98 41.76,39.98 43.74,41.96 LL.1 | 41.15,39.98 v32.77,39.98 31.55,41.2 28.04,41.2 27.74,40.89 25.15,40.89 24.99,41.05 v23.77,41.05 | v39.62,36.02 40.54,36.93 40.69,36.93 41.15,37.39 41.15,39.98 | v6.4,33.43 9.91,33.43 v13.72,37.24
LA+LL
  Top 0.152: R2.2 5.18,38.76 5.79,38.15 5.79,36.78 5.18,36.17 5.18,35.25 R1.2 5.18,35.1 11.12,35.1 12.34,33.88 12.34,33.58 M1.5
LL  (via drill 0.35)
  Top 0.152: v3.05,27.03 1.98,25.96 R9.1 | R2.1 5.03,37.39 5.03,36.47 2.29,33.73 2.29,30.68 LA.1 | R4.1 18.9,38.91 19.81,38.91 20.88,39.98 21.64,39.98 21.95,39.67 21.95,38.3 23.01,37.24 24.69,37.24 v25.3,37.85 26.36,38.91 M2.12 | v38.56,37.85 37.95,38.46 37.95,39.06 M3.14 | v40.23,37.85 40.23,39.06 M3.12 | R4.1.1 8.69,20.17 v9.3,20.78 | v20.42,24.13 21.49,25.2 R4.3.1
  Bottom 0.152: v3.05,27.03 3.05,29.77 2.29,30.53 LA.1 2.29,30.68 2.29,31.6 9.14,38.46 24.23,38.46 24.84,37.85 | v40.23,37.85 v38.56,37.85 v25.3,37.85 24.84,37.85 | v9.3,20.78 17.07,20.78 v20.42,24.13 20.42,35.41 21.95,36.93 23.93,36.93 24.84,37.85
N$1
  Top 0.152: 7.32,10.11 6.86,9.65 R1.9.2 | 7.32,10.11 8.08,10.87 10.21,10.87 10.67,10.41 10.67,10.26 E1.9 | 7.32,10.11 7.16,10.11 5.18,12.09 R1.8.1
N$2
  Top 0.152: E2.2 32.16,7.82 33.38,7.82 33.98,7.21 35.36,7.21 35.66,7.52 35.66,10.11 35.97,10.41 38.25,10.41 38.86,9.8 R2.3.2
N$3
  Top 0.152: E1.2 13.11,7.82 13.56,7.82 15.09,6.3 20.57,6.3 20.73,6.45 20.73,8.74 19.96,9.5 R1.3.2
N$4
  Top 0.152: E1.3 13.11,8.28 14.17,8.28 14.48,8.58 14.48,9.19 14.33,9.35 14.33,9.96 14.78,10.41 18.44,10.41 19.96,11.94 19.96,12.24 R1.4.2
N$5
  Top 0.152: E2.3 32.16,8.28 33.38,8.28 34.14,7.52 35.2,7.52 35.36,7.67 35.36,11.18 35.51,11.33 35.51,12.39 35.81,12.7 38.41,12.7 38.86,12.24 R2.4.2
N$6
  Top 0.152: C1.1.1 7.01,14.99 10.36,14.99 R1.7.1 10.52,14.99 11.28,15.75 12.8,15.75 12.95,15.6 12.95,14.68 15.54,12.09 R1.6.1
N$7
  Top 0.152: E1.7 11.73,10.26 11.73,11.94 12.04,12.24 C1.3.1 12.04,12.39 12.04,14.83 R1.7.2
N$8  (via drill 0.35)
  Top 0.152: v13.87,8.89 13.11,8.89 E1.4 | v15.39,13.16 17.22,14.99 C1.2.1
  Bottom 0.152: v13.87,8.89 15.09,8.89 15.54,9.35 15.54,13 v15.39,13.16
N$9
  Top 0.152: 18.9,14.83 19.96,14.83 R1.5.2 | 18.9,14.83 18.75,14.83 16.46,12.55 16.46,11.48 16.15,11.18 15.09,11.18 14.02,10.11 14.02,9.96 13.41,9.35 13.11,9.35 E1.5 | 18.9,14.83 17.98,15.75 16.46,15.75 15.7,14.99 C1.2.2
N$10  (via drill 0.35)
  Top 0.152: 11.73,6.15 11.73,6.45 E1.19 | 11.73,6.15 14.94,2.95 18.9,2.95 19.96,1.88 R1.13.1 | v18.14,11.02 18.14,11.18 17.37,11.94 R1.6.2 | v9.14,4.17 9.45,4.47 9.45,4.62 9.75,4.93 10.52,4.93 11.73,6.15
  Bottom 0.152: v18.14,11.02 18.44,11.02 22.86,6.6 22.86,5.38 22.55,5.08 10.06,5.08 v9.14,4.17
N$11  (via drill 0.35)
  Top 0.152: v13.26,10.11 12.19,10.11 E1.6 | v14.94,9.65 16.15,9.65 17.37,8.43 C1.6.1 17.53,8.28 18.59,7.21 19.81,7.21 R1.12.2
  Bottom 0.152: v13.26,10.11 14.48,10.11 v14.94,9.65
N$12
  Top 0.152: 8.38,3.1 8.38,4.32 9.3,5.23 10.21,5.23 11.12,6.15 11.12,6.45 E1.18 | 8.38,3.1 7.16,1.88 6.86,1.88 R1.14.2 | 8.38,3.1 8.84,2.64 10.97,2.64 11.73,1.88 12.04,1.88 C1.7.1 12.19,1.88 12.95,1.88 13.72,2.64 16.15,2.64 16.92,1.88 17.22,1.88 R1.10.2
N$13
  Top 0.152: R1.13.2 21.64,1.88 21.64,4.01 R1.11.2 21.64,4.17 21.64,7.06 R1.12.1
N$14
  Top 0.152: E1.20 12.19,6.45 12.5,6.45 15.24,3.71 16.46,3.71 17.37,4.62 C1.4.2 17.53,4.62 17.98,4.17 19.81,4.17 R1.11.1
N$15
  Top 0.152: E1.1 13.11,7.21 15.54,4.77 C1.4.1
N$16  (via drill 0.35)
  Top 0.152: v33.68,8.89 32.16,8.89 E2.4 | v36.88,13.77 36.88,14.38 36.42,14.83 C2.2.1
  Bottom 0.152: v33.68,8.89 36.27,8.89 36.88,9.5 v36.88,13.77
N$17  (via drill 0.35)
  Top 0.152: v33.38,10.11 32.61,9.35 32.16,9.35 E2.5 | v33.98,13.77 33.98,14.22 34.59,14.83 C2.2.2 34.75,14.83 35.51,15.6 37.03,15.6 37.8,14.83 R2.5.2
  Bottom 0.152: v33.38,10.11 33.38,13.16 v33.98,13.77
N$19
  Top 0.152: C2.1.1 26.06,14.83 29.41,14.83 R2.7.1 29.57,14.99 30.18,15.6 31.85,15.6 32,15.44 32,14.83 34.59,12.24 34.59,11.94 R2.6.1
N$20  (via drill 0.35)
  Top 0.152: v31.7,10.87 31.24,10.87 30.79,10.41 30.79,10.26 E2.7 | v32.31,12.09 31.7,12.09 31.24,12.55 C2.3.1 31.09,12.7 31.09,14.83 R2.7.2
  Bottom 0.152: v31.7,10.87 31.7,11.48 v32.31,12.09
N$21
  Top 0.152: E2.9 29.72,10.26 29.72,10.41 29.41,10.72 26.98,10.72 25.91,9.65 R2.9.2 25.76,9.65 24.99,10.41 24.69,10.41 24.23,10.87 24.23,12.24 R2.8.1
N$22
  Top 0.152: 38.56,2.18 38.86,1.88 R2.13.1 38.56,2.18 | 38.56,2.18 37.8,2.95 33.98,2.95 30.79,6.15 E2.19 | 38.56,2.18 39.78,3.4 39.78,10.26 39.62,10.41 39.32,10.41 37.95,11.79 36.42,11.79 R2.6.2
N$23  (via drill 0.35)
  Top 0.152: v32.46,10.11 31.39,10.11 E2.6 | v36.27,9.8 36.27,8.58 36.42,8.43 C2.6.1 36.58,8.43 37.8,7.21 38.86,7.21 R2.12.2
  Bottom 0.152: v32.46,10.11 33.07,9.5 35.97,9.5 v36.27,9.8
N$24
  Top 0.152: R2.13.2 40.69,1.88 40.69,4.01 R2.11.2 40.69,4.17 40.69,7.06 R2.12.1
N$25
  Top 0.152: E2.20 31.39,6.45 31.7,6.45 34.14,4.01 35.66,4.01 36.42,4.77 C2.4.2 36.58,4.77 37.19,4.17 38.86,4.17 R2.11.1
N$26
  Top 0.152: E2.1 32.16,7.21 34.59,4.77 C2.4.1
N$27
  Top 0.152: 32.46,2.64 32.46,4.01 30.33,6.15 30.33,6.45 E2.18 | 32.46,2.64 31.7,1.88 31.09,1.88 C2.7.1 30.94,1.73 30.33,1.12 28.65,1.12 28.04,1.73 25.91,1.73 R2.14.2 | 32.46,2.64 35.36,2.64 36.12,1.88 36.42,1.88 R2.10.2
N$28
  Top 0.152: E3.2 32.31,23.52 32.77,23.52 34.9,25.65 38.56,25.65 38.86,25.35 R3.3.2
N$29  (via drill 0.35)
  Top 0.152: v35.2,26.42 32.77,23.98 32.31,23.98 E3.3 | v37.64,28.85 38.1,28.85 38.86,28.09 R3.4.2
  Bottom 0.152: v37.64,28.85 v35.2,26.42
N$30  (via drill 0.35)
  Top 0.152: v33.68,26.72 33.68,25.35 32.77,24.43 32.31,24.43 E3.4 | v35.51,31.44 36.42,30.53 C3.2.1
  Bottom 0.152: v33.68,26.72 33.68,29.62 v35.51,31.44
N$31  (via drill 0.35)
  Top 0.152: v33.07,25.65 32.31,24.89 E3.5 | 35.36,29.62 35.36,29.77 34.75,30.38 C3.2.2 | 35.36,29.62 36.88,29.62 37.64,30.38 38.86,30.38 R3.5.2 | 35.36,29.62 v35.36,29.31
  Bottom 0.152: v33.07,25.65 33.53,25.65 35.36,27.48 v35.36,29.31
N$32
  Top 0.152: C3.1.1 26.06,30.53 29.41,30.53 R3.7.1 29.57,30.38 30.33,29.62 31.7,29.62 33.68,27.63 34.59,27.63 R3.6.1
N$33  (via drill 0.35)
  Top 0.152: E3.7 30.94,25.81 v30.94,27.03 30.94,27.94 31.09,28.09 C3.3.1 | v32.46,29.77 31.85,30.38 31.24,30.38 R3.7.2
  Bottom 0.152: v32.46,29.77 32.46,28.55 v30.94,27.03
N$34
  Top 0.152: 24.84,27.48 24.38,27.94 R3.8.1 | 24.84,27.48 25.15,27.18 28.65,27.18 29.72,26.11 29.72,25.81 E3.9 | 24.84,27.48 23.32,25.96 23.32,24.74 23.47,24.59 24.99,24.59 25.6,25.2 25.91,25.2 R3.9.2
N$35  (via drill 0.35)
  Top 0.152: 32.61,20.93 31.7,20.93 30.94,21.69 30.94,22 E3.19 | 32.61,20.93 34.75,18.8 37.64,18.8 38.86,17.58 R3.13.1 | v36.27,26.26 36.27,27.48 R3.6.2 | v35.66,22.76 34.44,22.76 32.61,20.93
  Bottom 0.152: v36.27,26.26 36.27,23.37 v35.66,22.76
N$36  (via drill 0.35)
  Top 0.152: v32,26.42 31.39,25.81 E3.6 | 36.58,22.91 36.58,23.98 C3.6.1 | 36.58,22.91 v36.58,22.45 | 36.58,22.91 38.86,22.91 R3.12.2
  Bottom 0.152: v32,26.42 32,24.74 34.44,22.3 34.44,21.54 34.75,21.23 35.36,21.23 v36.58,22.45
N$37
  Top 0.152: R3.13.2 40.69,17.58 40.69,20.01 R3.11.2 40.69,20.17 40.69,22.76 R3.12.1
N$38  (via drill 0.35)
  Top 0.152: v35.51,25.04 35.51,23.52 35.05,23.06 34.29,23.06 32.77,21.54 31.85,21.54 31.39,22 E3.20 | v35.05,21.84 36.27,20.62 C3.4.2 36.42,20.47 36.73,20.17 38.86,20.17 R3.11.1
  Bottom 0.152: v35.51,25.04 35.51,23.52 35.05,23.06 v35.05,21.84
N$39  (via drill 0.35)
  Top 0.152: v32.31,22.15 32.31,22.91 E3.1 | v33.53,20.93 34.29,20.93 34.59,20.62 C3.4.1
  Bottom 0.152: v33.53,20.93 v32.31,22.15
N$40
  Top 0.152: E3.18 30.33,21.84 31.55,20.62 31.85,20.62 32.61,19.86 32.61,18.49 | 32.61,18.49 31.7,17.58 31.24,17.58 C3.7.1 31.09,17.58 30.33,18.34 28.65,18.34 27.89,17.58 26.06,17.58 R3.14.2 | 32.61,18.49 35.2,18.49 36.12,17.58 36.42,17.58 R3.10.2
N$41  (via drill 0.35)
  Top 0.152: v17.37,22.91 14.63,22.91 14.02,23.52 E4.2 | v18.9,24.43 19.81,25.35 R4.3.2
  Bottom 0.152: v18.9,24.43 v17.37,22.91
N$42
  Top 0.152: R4.4.2 18.9,27.94 16.46,25.5 16.46,23.67 16,23.22 14.78,23.22 14.02,23.98 13.11,23.98 E4.3
N$43  (via drill 0.35)
  Top 0.152: v14.94,25.65 13.87,24.59 13.11,24.59 E4.4 | v16.31,29.46 17.22,30.38 C4.2.1
  Bottom 0.152: v14.94,25.65 14.94,28.09 v16.31,29.46
N$44
  Top 0.152: 16.31,28.55 16.31,27.03 16.15,26.87 14.94,26.87 14.63,27.18 14.02,27.18 13.72,26.87 13.72,26.26 13.87,26.11 13.87,25.5 13.41,25.04 13.11,25.04 E4.5 | 16.31,28.55 15.54,29.31 15.54,30.38 C4.2.2 | 16.31,28.55 16.76,28.55 18.59,30.38 19.81,30.38 R4.5.2
N$45
  Top 0.152: C4.1.1 6.86,30.53 10.36,30.53 R4.7.1 10.52,30.53 11.28,31.29 12.65,31.29 15.39,28.55 15.39,27.79 R4.6.1
N$46
  Top 0.152: C4.3.1 11.73,27.79 11.73,25.96 E4.7 | C4.3.1 12.04,30.38 R4.7.2 | C4.3.1
N$47  (via drill 0.35)
  Top 0.152: v8.23,25.35 8.23,26.11 8.69,26.57 10.36,26.57 10.67,26.26 10.67,25.96 E4.9 | R4.9.2 6.71,25.35 6.25,25.81 v6.25,26.42 5.18,27.48 5.18,27.94 R4.8.1
  Bottom 0.152: v8.23,25.35 7.32,25.35 v6.25,26.42
N$48  (via drill 0.35)
  Top 0.152: 12.19,21.54 12.65,21.08 12.95,21.08 15.39,18.64 18.9,18.64 19.96,17.58 R4.13.1 | 12.19,21.54 11.73,22 11.73,22.15 E4.19 | v16.31,26.26 17.07,27.03 17.07,27.63 R4.6.2 | 12.19,21.54 v12.19,21.39
  Bottom 0.152: v16.31,26.26 16.92,26.26 17.68,25.5 17.68,24.89 14.17,21.39 v12.19,21.39
N$49  (via drill 0.35)
  Top 0.152: v13.26,25.81 12.34,25.81 E4.6 | v17.07,25.2 17.07,24.13 C4.6.1 17.22,23.98 18.29,22.91 19.81,22.91 R4.12.2
  Bottom 0.152: v13.26,25.81 13.87,25.81 14.63,25.04 16.92,25.04 v17.07,25.2
N$50
  Top 0.152: R4.13.2 21.64,17.58 21.64,20.01 R4.11.2 21.64,20.17 21.64,22.76 R4.12.1
N$51
  Top 0.152: E4.20 12.34,22.15 14.78,19.71 16.15,19.71 17.07,20.62 C4.4.2 17.22,20.62 17.68,20.17 19.96,20.17 R4.11.1
N$52
  Top 0.152: E4.1 13.11,22.91 15.39,20.62 C4.4.1
N$53
  Top 0.152: 12.95,18.34 12.95,20.62 12.8,20.78 11.89,20.78 11.28,21.39 11.28,22.15 E4.18 | 12.95,18.34 12.19,17.58 C4.7.1 12.04,17.58 11.28,18.34 9.75,18.34 8.99,17.58 7.01,17.58 R4.14.2 | 12.95,18.34 16.46,18.34 17.22,17.58 R4.10.2
NEU  (via drill 0.35)
  Top 0.152: NEU.1 43.74,2.49 42.67,3.56 42.67,11.63 40.69,13.61 40.69,14.83 R2.5.1 40.54,14.83 39.47,15.9 | 39.47,15.9 23.93,15.9 23.01,14.99 21.79,14.99 R1.5.1 | v40.54,29.16 40.54,30.38 R3.5.1 | v40.23,23.98 39.78,23.52 39.78,16.2 39.47,15.9 | v28.35,28.7 28.19,28.85 23.93,28.85 22.4,30.38 21.79,30.38 R4.5.1
  Bottom 0.152: v40.23,23.98 40.54,24.28 v40.54,29.16 37.64,32.05 33.83,32.05 30.48,28.7 v28.35,28.7
RA  (via drill 0.35)
  Top 0.152: R8.1 1.98,21.08 1.22,20.32 1.22,16.97 | 1.22,16.97 1.22,3.25 2.13,2.34 RA.1 | v5.94,18.95 5.94,20.78 6.71,21.54 6.71,22.76 R4.2.1 | 21.03,33.88 21.34,33.58 M2.1 21.03,33.88 | 21.03,33.88 19.81,35.1 18.9,35.1 R3.1 18.75,35.1 14.02,35.1 13.11,34.19 | 21.03,33.88 21.64,34.49 | 21.64,34.49 22.1,34.95 30.02,34.95 30.94,34.04 32.77,34.04 R5.1 | v21.49,29.31 21.49,27.94 R4.4.1 | 21.64,34.49 v21.49,34.65 | 13.11,34.19 13.11,32.82 12.8,32.51 12.04,32.51 11.73,32.82 11.73,34.04 11.12,34.65 8.38,34.65 7.32,33.58 M1.1 7.32,33.43 5.94,32.05 5.94,29.92 6.25,29.62 6.25,29.01 5.94,28.7 5.94,27.33 6.1,27.18 6.4,27.18 7.62,25.96 7.62,24.59 7.47,24.43 5.18,24.43 4.27,23.52 4.27,18.8 2.44,16.97 1.22,16.97 | 13.11,34.19 11.89,35.41 9.6,35.41 6.71,38.3 6.71,39.83 6.86,39.98 8.99,39.98 9.14,39.83 9.14,39.67 9.75,39.06 M1.14
  Bottom 0.152: v5.94,18.95 5.94,6.15 6.25,5.84 6.25,5.23 3.35,2.34 2.29,2.34 RA.1 | v21.49,34.65 v21.49,29.31
RA+LA
  Top 0.152: 33.22,38.3 33.53,38 33.53,36.02 32.77,35.25 R5.2 | 33.22,38.3 32.77,38.76 R6.2 | 33.22,38.3 34.9,39.98 39.47,39.98 39.62,39.83 39.62,37.54 40.23,36.93 40.23,33.58 M3.5
RA+LL  (via drill 0.35)
  Top 0.152: 19.51,33.88 18.9,33.88 R3.2 | 19.51,33.88 20.88,32.51 21.64,32.51 21.95,32.82 21.95,34.19 22.4,34.65 25.3,34.65 26.36,33.58 M2.5 | v18.9,36.17 18.9,37.39 R4.2 | 19.51,33.88 v19.81,34.19
  Bottom 0.152: v18.9,36.17 18.9,35.1 v19.81,34.19
REFOUT_1  (via drill 0.35)
  Top 0.152: E1.8 11.12,10.26 11.12,11.48 10.36,12.24 C1.3.2 10.21,12.24 8.69,12.24 | 8.69,12.24 6.86,12.24 R1.8.2 | v14.63,7.67 15.24,8.28 15.54,8.28 C1.6.2 | 8.69,12.24 v8.69,11.48
  Bottom 0.152: v14.63,7.67 11.12,7.67 8.69,10.11 v8.69,11.48
REFOUT_2
  Top 0.152: 30.18,11.48 30.18,11.79 29.41,12.55 C2.3.2 29.26,12.55 29.11,12.39 26.06,12.39 R2.8.2 | 30.18,11.48 30.18,10.26 E2.8 | 30.18,11.48 32.92,11.48 34.59,9.8 34.59,8.43 C2.6.2
REFOUT_3  (via drill 0.35)
  Top 0.152: 30.33,26.72 30.33,27.33 29.57,28.09 C3.3.2 29.41,28.09 26.06,28.09 R3.8.2 | 30.33,26.72 E3.8 | v33.07,22.76 34.29,23.98 34.59,23.98 C3.6.2 | 30.33,26.72 v30.02,26.72
  Bottom 0.152: v33.07,22.76 33.07,23.22 30.02,26.26 v30.02,26.72
REFOUT_4  (via drill 0.35)
  Top 0.152: 11.28,26.72 11.28,27.18 10.36,28.09 C4.3.2 6.86,28.09 R4.8.2 | 11.28,26.72 11.28,25.96 E4.8 | v14.33,26.57 14.94,26.57 15.54,25.96 15.54,25.35 15.39,25.2 15.39,24.13 C4.6.2 | 11.28,26.72 v11.12,26.72
  Bottom 0.152: v14.33,26.57 11.28,26.57 v11.12,26.72
S0  (via drill 0.35)
  Top 0.152: v22.86,40.59 16.46,40.59 14.94,39.06 M1.10 | M2.10 28.8,39.06 28.8,39.67 28.35,40.13 v28.35,40.59 28.96,41.2 40.84,41.2 42.82,39.22 M3.10 42.98,39.06 v42.98,37.39 | v42.67,25.65 42.67,13.92 43.74,12.85 43.74,11.94 J1.7
  Bottom 0.152: v22.86,40.59 23.32,40.59 23.47,40.44 28.19,40.44 v28.35,40.59 | v42.67,25.65 42.67,37.08 v42.98,37.39
S1  (via drill 0.35)
  Top 0.152: v17.22,39.98 16.31,39.06 M1.9 | M2.9 30.18,39.22 v30.94,39.98 31.55,40.59 40.08,40.59 41,39.67 41,38.46 42.67,36.78 | 42.67,36.78 43.28,36.78 44.04,37.54 44.04,39.06 M3.9 | v42.06,24.89 v42.06,16.2 | 42.67,36.78 v42.06,36.17
  Bottom 0.152: v30.94,39.98 v17.22,39.98 | v42.06,16.2 J1.6 | v42.06,36.17 v42.06,24.89
SDN  (via drill 0.35)
  Top 0.152: J1.1 43.74,27.18 42.98,27.94 42.98,30.38 R0.1 42.98,30.53 42.98,30.99 44.81,32.82 44.81,34.19 43.74,35.25 v40.84,35.25 | v7.92,9.5 8.99,8.43 9.3,8.43 E1.13 | v8.53,23.67 8.84,23.67 9.3,24.13 E4.13 | v27.43,8.58 27.74,8.28 28.35,8.28 E2.13 | v26.67,24.28 26.98,23.98 28.35,23.98 E3.13
  Bottom 0.152: v7.92,9.5 7.92,12.24 7.62,12.55 7.62,13.77 | 7.62,13.77 7.62,14.99 8.53,15.9 v8.53,23.67 | v27.43,8.58 27.43,9.04 25.45,11.02 25.45,11.48 23.93,13 | 23.93,13 16.46,13 15.7,13.77 7.62,13.77 | 23.93,13 23.93,16.66 26.67,19.41 v26.67,24.28 26.52,24.43 26.52,30.23 29.11,32.82 36.73,32.82 39.17,35.25 v40.84,35.25
SIGNAL_1  (via drill 0.35)
  Top 0.152: v9.45,10.26 10.06,10.26 E1.10 | v8.23,12.85 7.62,12.85 6.4,14.07 5.94,14.07 5.79,14.22 | 5.79,14.22 5.18,14.83 C1.1.2 | 5.79,14.22 4.27,12.7 4.27,11.63 5.03,10.87 5.03,9.65 R1.9.1 | v27.89,11.33 24.99,11.33 v24.84,11.18
  Bottom 0.152: v8.23,12.85 9.45,11.63 v9.45,10.26 11.43,8.28 14.94,8.28 15.85,9.19 15.85,9.65 17.83,11.63 18.44,11.63 18.9,11.18 v24.84,11.18 | J1.5 42.67,16.97 42.22,17.42 33.98,17.42 v27.89,11.33
SIGNAL_2  (via drill 0.35)
  Top 0.152: E2.10 29.26,10.11 v28.5,10.11 27.89,10.11 26.67,8.89 24.84,8.89 24.23,9.5 R2.9.1 24.08,9.65 23.32,10.41 23.32,12.85 24.23,13.77 24.23,14.83 C2.1.2
  Bottom 0.152: v28.5,10.11 35.51,17.12 42.06,17.12 42.67,16.51 42.67,16.36 43.28,15.75 44.35,15.75 45.11,16.51 45.11,17.42 43.89,18.64 43.89,19.41 J1.4
SIGNAL_3  (via drill 0.35)
  Top 0.152: 27.13,25.81 26.82,25.81 26.52,26.11 24.99,26.11 24.23,25.35 R3.9.1 | 27.13,25.81 29.26,25.81 E3.10 | v27.13,29.92 26.82,29.62 25.45,29.62 24.69,30.38 24.38,30.38 C3.1.2 | 27.13,25.81 v27.13,26.26
  Bottom 0.152: v27.13,26.26 v27.13,29.92 29.72,32.51 39.01,32.51 41.45,34.95 41.45,36.78 42.67,38 43.28,38 45.11,36.17 45.11,24.13 43.89,22.91 43.89,22.15 J1.3
SIGNAL_4  (via drill 0.35)
  Top 0.152: v8.99,25.96 10.21,25.96 E4.10 | C4.1.2 5.18,30.38 5.64,29.92 v5.64,29.31 5.03,29.31 4.27,28.55 4.27,27.33 5.03,26.57 5.03,25.35 R4.9.1 | v38.41,35.41 39.62,34.19 39.62,32.97 41.45,31.14 41.45,27.79 43.74,25.5 43.74,24.59 J1.2 | v22.86,35.56 20.42,35.56 v19.81,36.17
  Bottom 0.152: v5.64,29.31 6.86,28.09 | 6.86,28.09 v8.99,25.96 | v38.41,35.41 23.01,35.41 v22.86,35.56 | v19.81,36.17 19.2,36.78 18.59,36.78 18.29,36.47 18.29,34.8 19.51,33.58 19.81,33.58 20.12,33.27 20.12,32.66 19.81,32.36 12.04,32.36 11.89,32.51 11.28,32.51 6.86,28.09
V1
  Top 0.152: M1.15 8.69,38.91 9.45,38.15 10.21,38.15 10.36,38.3 10.36,39.83 9.91,40.28 5.33,40.28 2.29,37.24 2.29,36.78 V1.1
V2
  Top 0.152: M2.15 22.55,39.52 21.79,40.28 18.75,40.28 15.09,36.63 13.41,36.63 11.73,38.3 11.73,39.67 10.52,40.89 3.35,40.89 2.29,41.96 V2.1
V3  (via drill 0.35)
  Top 0.152: v37.8,37.24 36.58,38.46 36.58,39.06 M3.15
  Bottom 0.152: v37.8,37.24 40.54,37.24 40.84,37.54 40.84,38.15 39.62,39.37 11.12,39.37 8.53,41.96 V3.1
V4
  Top 0.152: M1.11 13.72,39.06 13.72,41.35 14.48,42.11 V4.1
V5
  Top 0.152: M2.11 27.58,39.06 25.76,40.89 24.84,40.89 23.77,41.96 20.27,41.96 V5.1
V6
  Top 0.152: M3.11 41.6,39.22 41.6,39.52 40.23,40.89 30.79,40.89 29.57,39.67 29.57,38.46 29.26,38.15 28.5,38.15 28.19,38.46 28.19,39.83 25.91,42.11 V6.1
WCT  (via drill 0.35)
  Top 0.152: 37.34,34.34 36.58,33.58 M3.2 | 37.34,34.34 38.25,34.34 39.01,33.58 M3.4 | v37.19,34.49 37.34,34.34 | v25.76,32.36 25.76,32.82 25.15,33.43 M2.4 24.99,33.58 24.23,34.34 23.32,34.34 22.55,33.58 M2.2 22.55,32.97 21.79,32.21 20.27,32.21 v19.51,32.97 | M1.4 10.97,33.58 10.21,34.34 9.45,34.34 8.69,33.58 M1.2 8.53,33.43 v7.32,32.21 | R7.2 1.98,20.62 2.74,21.39 2.74,22.3 1.98,23.06 R8.2 1.98,23.22 1.22,23.98 1.22,26.26 1.98,27.03 R9.2 1.98,27.18 3.35,28.55 3.35,30.84 v5.49,32.97
  Bottom 0.152: v37.19,34.49 27.89,34.49 v25.76,32.36 | v5.49,32.97 6.25,32.21 v7.32,32.21 8.08,32.97 v19.51,32.97